# EAGLE design LayerOne2015 (EAGLE 7.2.0)

## Sheet 1 of 2
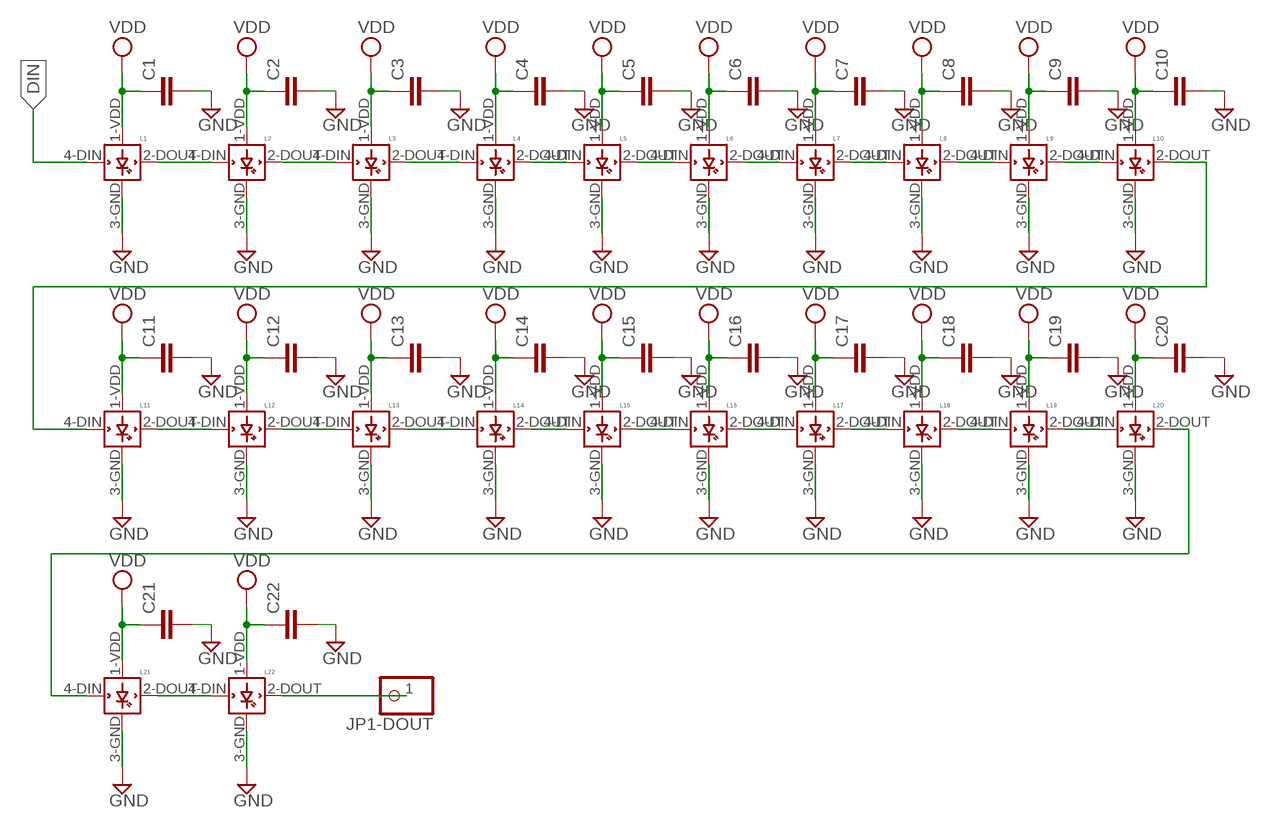
[diagram p0: schematic, sheet 1]

### Parts
C1  CAP0805  [0805]
C2  CAP0805  [0805]
C3  CAP0805  [0805]
C4  CAP0805  [0805]
C5  CAP0805  [0805]
C6  CAP0805  [0805]
C7  CAP0805  [0805]
C8  CAP0805  [0805]
C9  CAP0805  [0805]
C10  CAP0805  [0805]
C11  CAP0805  [0805]
C12  CAP0805  [0805]
C13  CAP0805  [0805]
C14  CAP0805  [0805]
C15  CAP0805  [0805]
C16  CAP0805  [0805]
C17  CAP0805  [0805]
C18  CAP0805  [0805]
C19  CAP0805  [0805]
C20  CAP0805  [0805]
C21  CAP0805  [0805]
C22  CAP0805  [0805]
JP1-DOUT  PINHD-1X1CB  [1X01-CLEANBIG]
L1  WS2812B  [WS2812B]
L2  WS2812B  [WS2812B]
L3  WS2812B  [WS2812B]
L4  WS2812B  [WS2812B]
L5  WS2812B  [WS2812B]
L6  WS2812B  [WS2812B]
L7  WS2812B  [WS2812B]
L8  WS2812B  [WS2812B]
L9  WS2812B  [WS2812B]
L10  WS2812B  [WS2812B]
L11  WS2812B  [WS2812B]
L12  WS2812B  [WS2812B]
L13  WS2812B  [WS2812B]
L14  WS2812B  [WS2812B]
L15  WS2812B  [WS2812B]
L16  WS2812B  [WS2812B]
L17  WS2812B  [WS2812B]
L18  WS2812B  [WS2812B]
L19  WS2812B  [WS2812B]
L20  WS2812B  [WS2812B]
L21  WS2812B  [WS2812B]
L22  WS2812B  [WS2812B]

### Nets
DIN: L1.4-DIN(DIN) ; also sheet 2
GND: C1.2 C2.2 C3.2 C4.2 C5.2 C6.2 C7.2 C8.2 C9.2 C10.2 C11.2 C12.2 C13.2 C14.2 C15.2 C16.2 C17.2 C18.2 C19.2 C20.2 C21.2 C22.2 L1.3-GND(GND) L2.3-GND(GND) L3.3-GND(GND) L4.3-GND(GND) L5.3-GND(GND) L6.3-GND(GND) L7.3-GND(GND) L8.3-GND(GND) L9.3-GND(GND) L10.3-GND(GND) L11.3-GND(GND) L12.3-GND(GND) L13.3-GND(GND) L14.3-GND(GND) L15.3-GND(GND) L16.3-GND(GND) L17.3-GND(GND) L18.3-GND(GND) L19.3-GND(GND) L20.3-GND(GND) L21.3-GND(GND) L22.3-GND(GND) ; also sheet 2
N$1: L1.2-DOUT(DOUT) L2.4-DIN(DIN)
N$2: L3.2-DOUT(DOUT) L4.4-DIN(DIN)
N$3: L4.2-DOUT(DOUT) L5.4-DIN(DIN)
N$4: L5.2-DOUT(DOUT) L6.4-DIN(DIN)
N$5: L6.2-DOUT(DOUT) L7.4-DIN(DIN)
N$6: L7.2-DOUT(DOUT) L8.4-DIN(DIN)
N$7: L8.2-DOUT(DOUT) L9.4-DIN(DIN)
N$8: L9.2-DOUT(DOUT) L10.4-DIN(DIN)
N$9: L11.2-DOUT(DOUT) L12.4-DIN(DIN)
N$10: L12.2-DOUT(DOUT) L13.4-DIN(DIN)
N$11: L13.2-DOUT(DOUT) L14.4-DIN(DIN)
N$12: L14.2-DOUT(DOUT) L15.4-DIN(DIN)
N$13: L15.2-DOUT(DOUT) L16.4-DIN(DIN)
N$14: L16.2-DOUT(DOUT) L17.4-DIN(DIN)
N$15: L17.2-DOUT(DOUT) L18.4-DIN(DIN)
N$16: L18.2-DOUT(DOUT) L19.4-DIN(DIN)
N$17: L19.2-DOUT(DOUT) L20.4-DIN(DIN)
N$18: L21.2-DOUT(DOUT) L22.4-DIN(DIN)
N$19: JP1-DOUT.1 L22.2-DOUT(DOUT)
N$25: L10.2-DOUT(DOUT) L11.4-DIN(DIN)
N$26: L20.2-DOUT(DOUT) L21.4-DIN(DIN)
N$27: L2.2-DOUT(DOUT) L3.4-DIN(DIN)
VCC: C1.1 C2.1 C3.1 C4.1 C5.1 C6.1 C7.1 C8.1 C9.1 C10.1 C11.1 C12.1 C13.1 C14.1 C15.1 C16.1 C17.1 C18.1 C19.1 C20.1 C21.1 C22.1 L1.1-VDD(VDD) L2.1-VDD(VDD) L3.1-VDD(VDD) L4.1-VDD(VDD) L5.1-VDD(VDD) L6.1-VDD(VDD) L7.1-VDD(VDD) L8.1-VDD(VDD) L9.1-VDD(VDD) L10.1-VDD(VDD) L11.1-VDD(VDD) L12.1-VDD(VDD) L13.1-VDD(VDD) L14.1-VDD(VDD) L15.1-VDD(VDD) L16.1-VDD(VDD) L17.1-VDD(VDD) L18.1-VDD(VDD) L19.1-VDD(VDD) L20.1-VDD(VDD) L21.1-VDD(VDD) L22.1-VDD(VDD) ; supply symbol labelled VDD ; also sheet 2

## Sheet 2 of 2
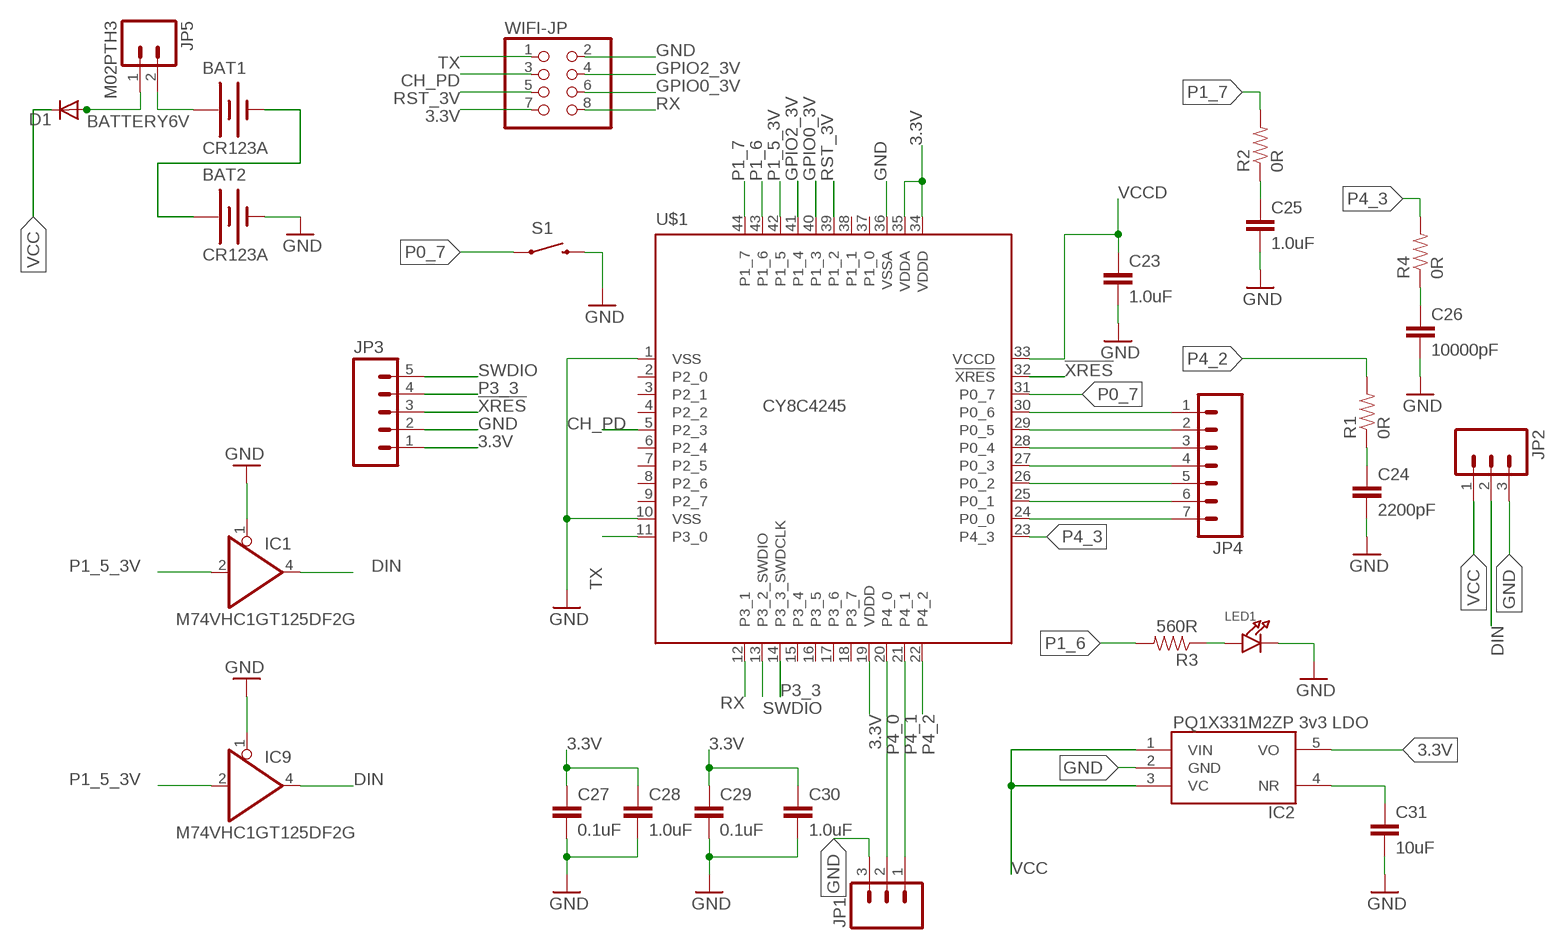
[diagram p1: schematic, sheet 2]

### Parts
BAT1  CR123A  TVBGONE-ADJ_BATTERYCR123A  [TVBGONE-ADJ_BATTERY_CR123A]
BAT2  CR123A  TVBGONE-ADJ_BATTERYCR123A  [TVBGONE-ADJ_BATTERY_CR123A]
C23  1.0uF  CAP0805  [0805]
C24  2200pF  CAP0805  [0805]
C25  1.0uF  CAP0805  [0805]
C26  10000pF  CAP0805  [0805]
C27  0.1uF  CAP0805  [0805]
C28  1.0uF  CAP0805  [0805]
C29  0.1uF  CAP0805  [0805]
C30  1.0uF  CAP0805  [0805]
C31  10uF  CAP0805  [0805]
D1  DIODESMA  [SMA-DIODE]
IC1  M74VHC1GT125DF2G  74AHCT1G125DBV  [SOT23-5]
IC2  PQ1X331M2ZP-3V3-LDO-SOT-23-5  [SOT-23-5]
IC9  M74VHC1GT125DF2G  74AHC1G125DCK  [SC70-5]
JP1  M031X03_NO_SILK  [1X03_NO_SILK]
JP2  M031X03_NO_SILK  [1X03_NO_SILK]
JP3  M05PTH  [1X05]
JP4  M07  [1X07]
JP5  M02PTH3  [1X02_LONGPADS]
LED1  LED0805  [CHIPLED_0805]
R1  0R  RESISTOR0805-RES  [0805]
R2  0R  RESISTOR0805-RES  [0805]
R3  560R  RESISTOR0805-RES  [0805]
R4  0R  RESISTOR0805-RES  [0805]
S1  SPARKFUN_SWITCH-MOMENTARY-2SMD  [SPARKFUN_TACTILE_SWITCH_SMD]
U$1  CY8C4245  CY8C4245AXI-483  [TQFP44]
WIFI-JP  PINHD-2X4  [2X04]

### Nets
3.3V: C27.1 C28.1 C29.1 C30.1 IC2.5(VO) JP3.1 U$1.19(VDDD) U$1.34(VDDD) U$1.35(VDDA) WIFI-JP.7
!XRES: JP3.3 U$1.32(!XRES)
BATTERY6V: D1.A JP5.1
CH_PD: U$1.5(P2_3) WIFI-JP.3
DIN: IC1.4(O) IC9.4(O) JP2.2 ; also sheet 1
GND: BAT2.- C23.2 C24.2 C25.2 C26.2 C27.2 C28.2 C29.2 C30.2 C31.2 IC1.1(OE) IC2.2(GND) IC9.1(OE) JP1.3 JP2.3 JP3.2 LED1.C S1.3 U$1.1(VSS) U$1.10(VSS) U$1.36(VSSA) WIFI-JP.2 ; also sheet 1
GPIO0_3V: U$1.40(P1_3) WIFI-JP.6
GPIO2_3V: U$1.41(P1_4) WIFI-JP.4
N$20: C24.1 R1.1
N$21: C25.1 R2.1
N$22: C26.1 R4.1
N$23: LED1.A R3.1
N$24: C31.1 IC2.4(NR)
N$28: BAT1.- BAT2.+
N$29: JP4.7 U$1.24(P0_0)
N$30: JP4.6 U$1.25(P0_1)
N$31: JP4.5 U$1.26(P0_2)
N$32: JP4.4 U$1.27(P0_3)
N$33: JP4.3 U$1.28(P0_4)
N$34: JP4.2 U$1.29(P0_5)
N$35: JP4.1 U$1.30(P0_6)
N$36: BAT1.+ JP5.2
P0_7: S1.1 U$1.31(P0_7)
P1_5_3V: IC1.2(I) IC9.2(I) U$1.42(P1_5)
P1_6: R3.2 U$1.43(P1_6)
P1_7: R2.2 U$1.44(P1_7)
P3_3: JP3.4 U$1.14(P3_3_SWDCLK)
P4_0: JP1.2 U$1.20(P4_0)
P4_1: JP1.1 U$1.21(P4_1)
P4_2: R1.2 U$1.22(P4_2)
P4_3: R4.2 U$1.23(P4_3)
RST_3V: U$1.39(P1_2) WIFI-JP.5
RX: U$1.12(P3_1) WIFI-JP.8
SWDIO: JP3.5 U$1.13(P3_2_SWDIO)
TX: U$1.11(P3_0) WIFI-JP.1
VCC: D1.C IC2.1(VIN) IC2.3(VC) JP2.1 ; also sheet 1
VCCD: C23.1 U$1.33(VCCD)
Unconnected: U$1.2(P2_0) U$1.3(P2_1) U$1.4(P2_2) U$1.6(P2_4) U$1.7(P2_5) U$1.8(P2_6) U$1.9(P2_7) U$1.15(P3_4) U$1.16(P3_5) U$1.17(P3_6) U$1.18(P3_7) U$1.37(P1_0) U$1.38(P1_1)

## Power pins joined to a net without a drawn wire
GND: IC1.3(GND) IC9.3(GND)
VCC: IC1.5(VCC) IC9.5(VCC)

## Library data of the parts
BAT1 BAT2 = tvbgone-2layer:TVBGONE-ADJ_BATTERY: Battery Holders Various common sizes : AA, AAA, 20mm coin cell and 12mm coin cell.
C1-C22 = SparkFun-Passives:CAP: Capacitor Standard 0603 ceramic capacitor, and 0.1" leaded capacitor.
C23-C31 = SparkFun-Capacitors:CAP: Capacitor Standard 0603 ceramic capacitor, and 0.1" leaded capacitor.
D1 = SparkFun-DiscreteSemi:DIODE: Diode These are standard reverse protection diodes and small signal diodes. SMA package can handle up to about 1A. SOD-323 can handle about 200mA. What the SOD-323 package when ordering, there are some mfgs out there that are 5-pin packages.
IC1 IC9 = 74xx-little-de:74*1G125: Single Bus Buffer Gate with 3-State Output; DIGIKEY-ND: M74VHC1GT125DF1GOSCT-ND; MOUSER: 863-M74VHC1GT125DF2G; PARTNO: M74VHC1GT125DF2G
IC2 = STM32-PROX:PQ1X331M2ZP-3V3-LDO-SOT-23-5
JP1 JP2 = SparkFun-Connectors:M03: Header 3 Standard 3-pin 0.1" header. Use with straight break away headers (SKU : PRT-00116), right angle break away headers (PRT-00553), swiss pins (PRT-00743), machine pins (PRT-00117), and female headers (PRT-00115). Molex polarized connector foot print use with SKU : PRT-08232 with associated crimp pins and housings.
JP1-DOUT = adafruit:PINHD-1X1: Pin header 1x1 for 0.1" spacing With round pins
JP3 = SparkFun-Connectors:M05: Header 5 Standard 5-pin 0.1" header. Use with straight break away headers (SKU : PRT-00116), right angle break away headers (PRT-00553), swiss pins (PRT-00743), machine pins (PRT-00117), and female headers (PRT-00115). Molex polarized connector foot print use with SKU : PRT-08230 with associated crimp pins and housings.
JP4 = SparkFun:M07: Header 7 Standard 7-pin 0.1" header. Use with straight break away headers (SKU : PRT-00116), right angle break away headers (PRT-00553), swiss pins (PRT-00743), machine pins (PRT-00117), and female headers (PRT-00115). NOTES ON THE VARIANTS LOCK and LOCK_LONGPADS... This footprint was designed to help hold the alignment of a through-hole component (i.e. 7-pin header) while soldering it into place. You may notice that each hole has been shifted either up or down by 0.005 of an inch from it's more standard position (which is usually a perfectly straight line). This slight alteration caused the pins (the squares in the middle) to touch the edges of the holes. Because they are alternating, it causes a "brace" to hold the header in place. 0.005 has proven to be the perfect amount of "off-center" position when using our standard breakaway headers. Although looks a little odd when you look at the bare footprint, once you have a header in there, the alteration is very hard to notice. Also, if you push a header all the way into place, it is covered up entirely on the bottom side. This idea of altering the position of holes to aid alignment will be further integrated into the Sparkfun Library for other footprints. It can help hold any component with 3 or more connection pins.
JP5 = SparkFun-Connectors:M02: Standard 2-pin 0.1" header. Use with - straight break away headers ( PRT-00116) - right angle break away headers (PRT-00553) - swiss pins (PRT-00743) - machine pins (PRT-00117) - female headers (PRT-00115) Molex polarized connector foot print use with: PRT-08233 with associated crimp pins and housings. 2.54_SCREWTERM for use with PRT-10571. 3.5mm Screw Terminal footprints for PRT-08084 5mm Screw Terminal footprints for use with PRT-08433
L1-L22 = adafruit:WS2812B
LED1 = microbuilder:LED: LED 0603 - 0603 Surface Mount Package Green LED - Low Power (3.9mcd, 2ma, 1.7Vf) Orange LED - Low Power (9.8mcd, 2ma, 1.8Vf) Red LED - Low Power (5mcd, 2ma, 1.8Vf) Yellow LED - Low Power (7mcd, 2ma, 1.8Vf) 0805 - 0805 Surface Mount Package 20mA: Red LED (104mcd, 20mA, Diffused) - LS R976 [Digikey: 475-1278-6-ND] Red LED (12mcd, 20mA, 2.0Vf, Clear) - APT2012EC [Digikey: 754-1128-1-ND] Green LED (15mcd, 20mA, 2.2Vf, Clear) - APT2012GC [Digikey: 754-1131-1-ND] Orange LED (160mcd, 20mA, 2.1Vf, Clear) - APT2012SECK [Digikey: 754-1130-1-ND] 2mA: Red LED (8.8mcd, 2mA, 1.8Vf, Clear) - Low Power [Digikey: 475-2510-1-ND] Green LED (5mcd, 2mA, 1.8Vf, Clear) - Low Power [Digikey: 475-2730-1-ND] Yellow LED (11.3mcd, 2mA, 1.8Vf, Clear) - Low Power [Digikey: 475-2555-1-ND] 1206 - 1206 Surface Mount Package Green LED (26mcd, 20mA, Diffused) - LG N971 [Digikey: 475-1407-6-ND] Red LED (15mcd, 20mA, Diffused) - LH N974 [Digikey: 475-1416-6-ND]
R1-R4 = SparkFun-Resistors:RESISTOR: Resistor Basic schematic elements and footprints for 0603, 1206, and PTH resistors.
S1 = Nullspace:SPARKFUN_SWITCH-MOMENTARY-2
U$1 = cypress:CY8C4245AXI-483
WIFI-JP = pinhead:PINHD-2X4: PIN HEADER

## Net classes
0 default: width 0.203 mm

## Board
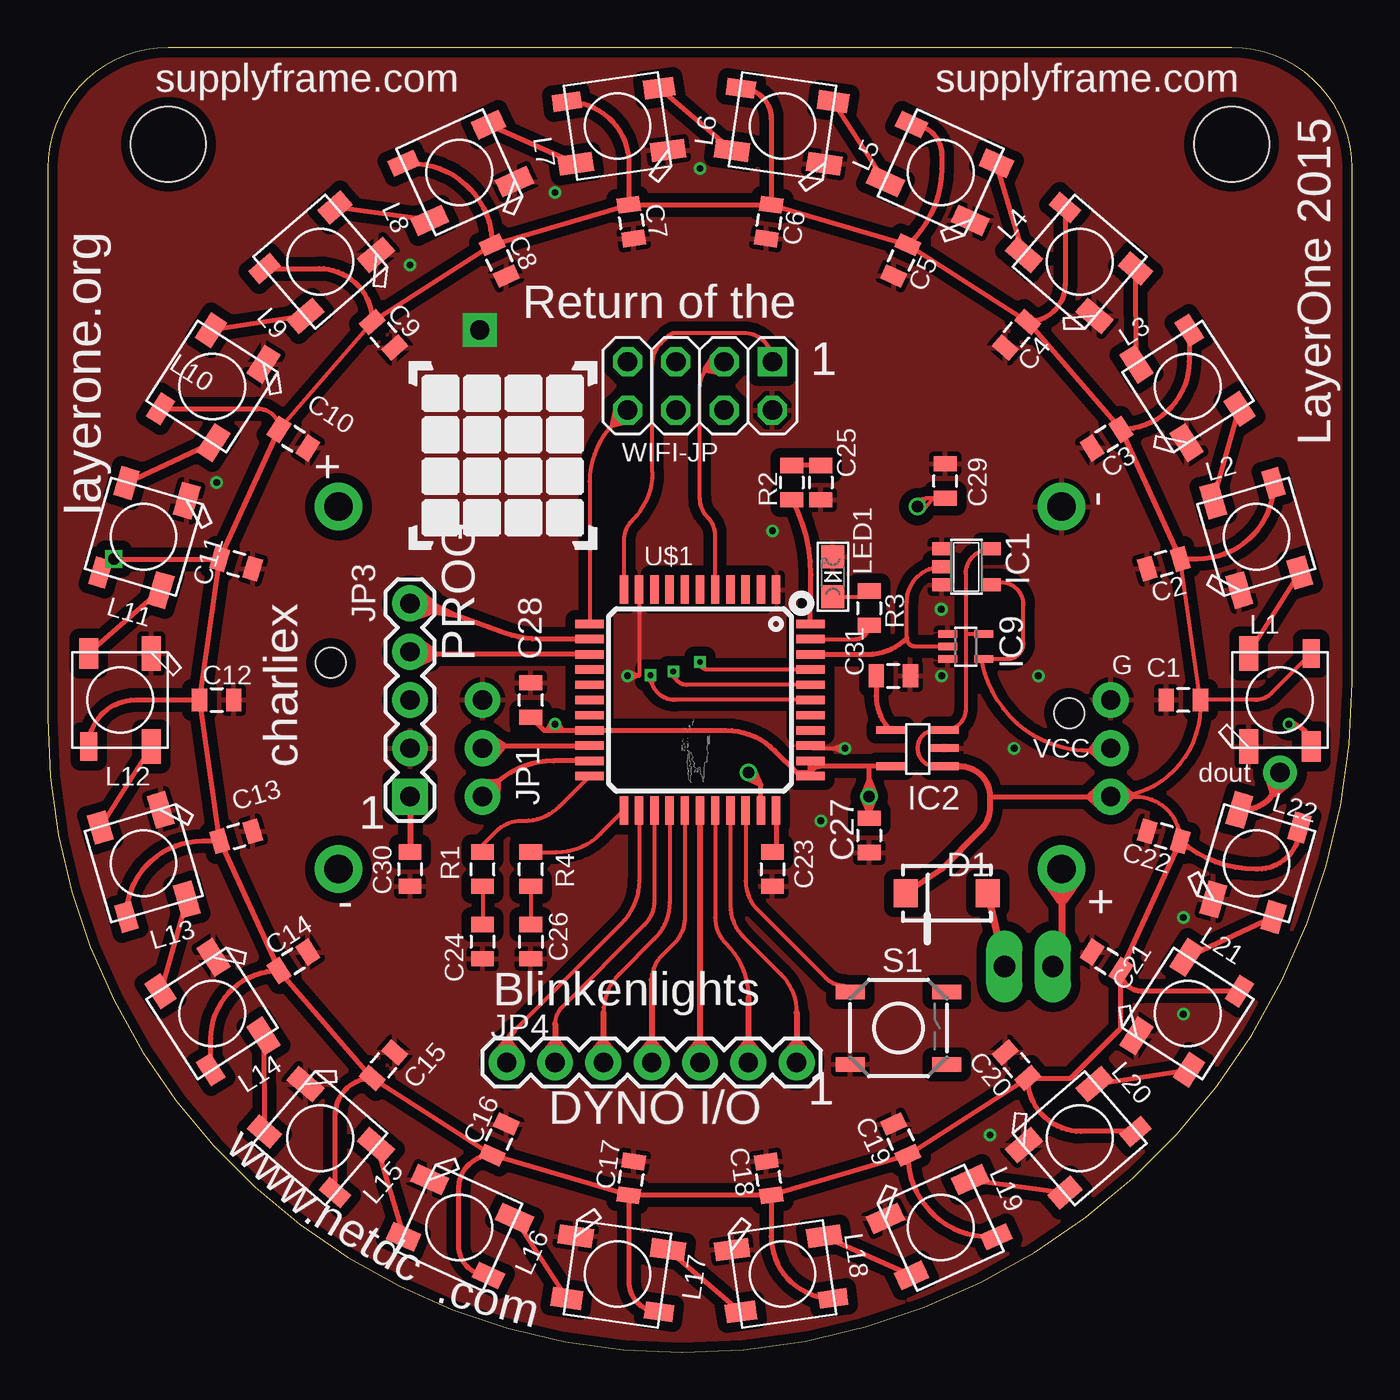
[diagram p2: board, top side]
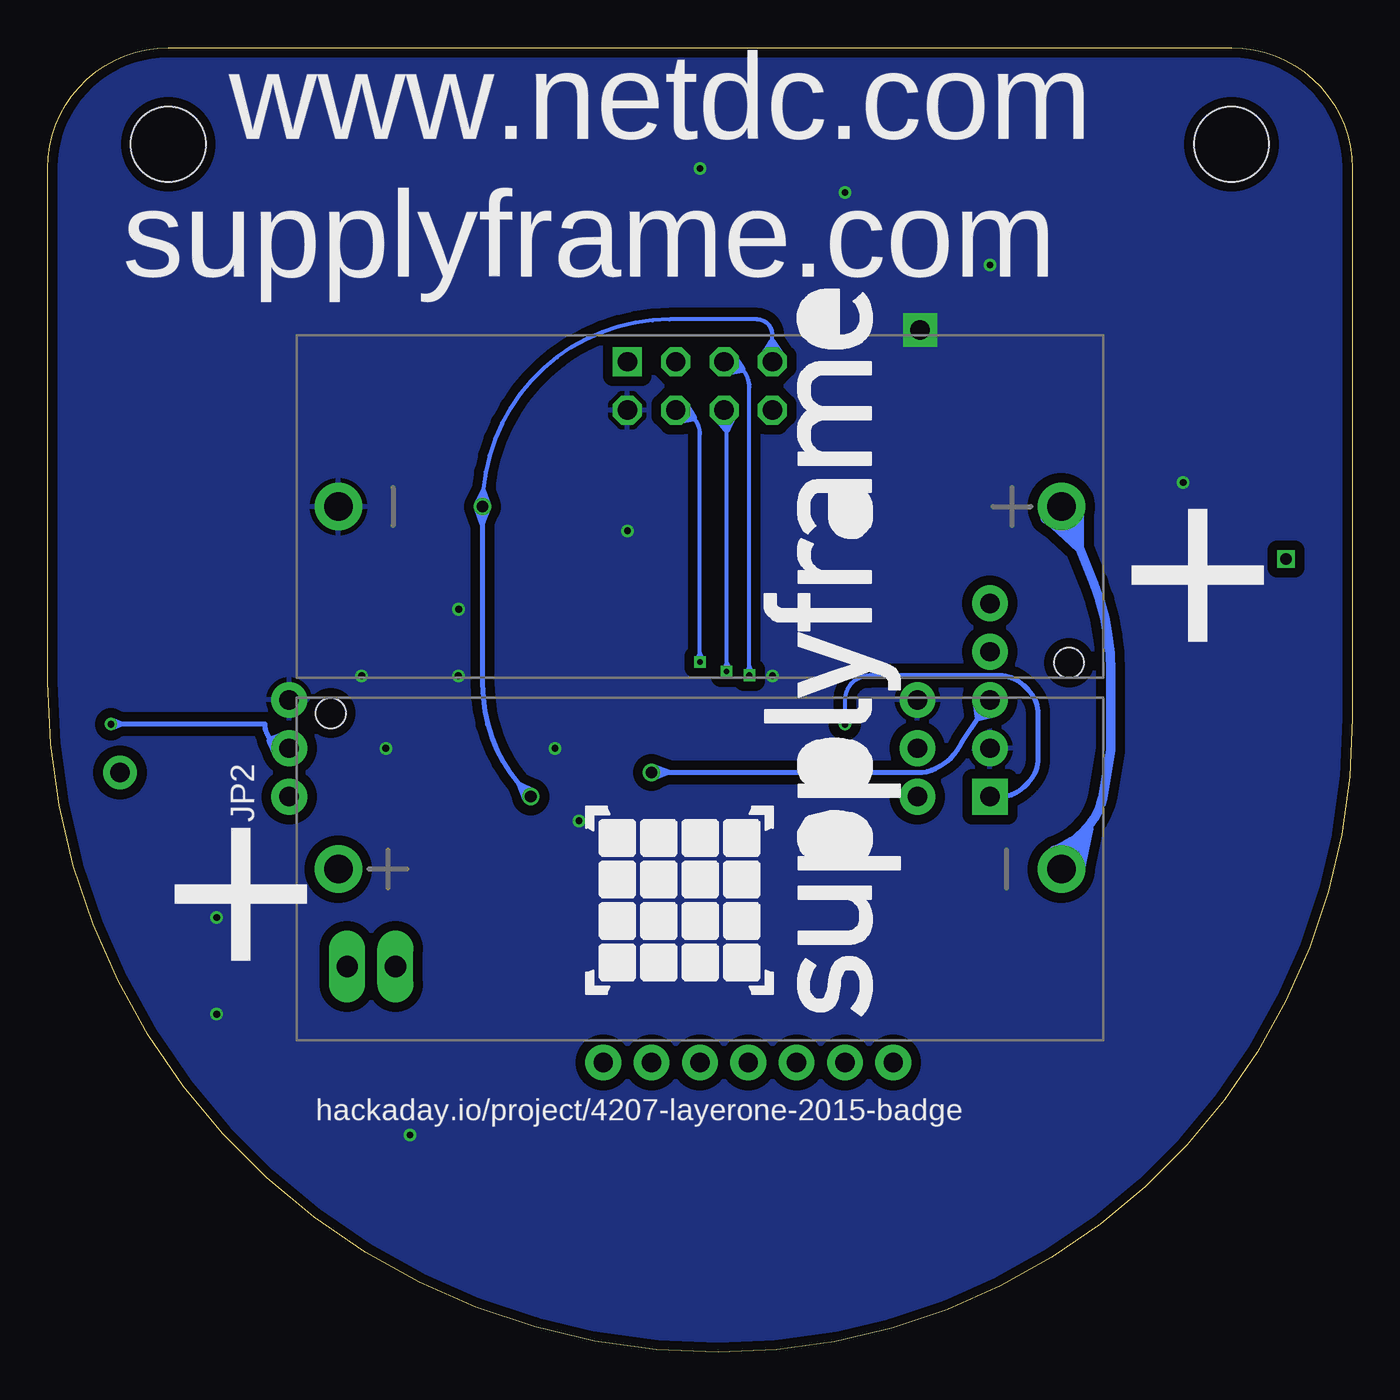
[diagram p3: board, bottom side, seen from below]

Size 68.58 x 68.58 mm. Coordinates in mm from the lower left corner, seen from the top.
Outline: 0,33.34 arc90 33.34,0 arc90 68.56,35.22 68.58,62.23 arc90 62.23,68.58 6.35,68.58 arc90 0,62.23 0,33.34
Copper layers (1*16): Top 0.035mm / dielectric 1.5mm / Bottom 0.035mm
Design rules "ITEADstudio_DRC": minimum track width 6mil, minimum drill 12mil, track to track 6mil, track to pad 6mil, pad to pad 6mil, via to via 6mil, smd to smd 0mil, copper to edge 10mil, drill to drill 10mil, minimum pad ring 10mil, minimum via ring 6mil, stop-mask expansion 2mil, vias tented up to drill 100mil, thermal gap 10mil
Holes 3.94 mm at 62.23,63.5 6.35,63.5
Milling: 7 lines

### Footprints (pad centres in the part's own frame; a part is rotated, then mirrored left to right if it is on the bottom)
TVBGONE-ADJ_BATTERY_CR123A = drill 1.5 pad 2.5: + 19,0; - -19,0 | hole 1.575: 19.4,-8.2
0805 = smd 0.8 x 1.2: 1 -0.9,0; 2 0.9,0
SMA-DIODE = smd 1.27 x 1.47: A -2.15,0; C 2.15,0
SOT23-5 = smd 0.69 x 0.99: 1 -0.95,-1.29; 2 0,-1.29; 3 0.95,-1.29; 4 0.95,1.3; 5 -0.95,1.3
SOT-23-5 = smd 0.4 x 1.5: 1 -0.94,-1.422; 2 0.01,-1.422; 3 0.96,-1.422; 4 0.96,1.428; 5 -0.94,1.428
SC70-5 = smd 0.4 x 1: 1 -0.65,-0.95; 2 0,-0.95; 3 0.65,-0.95; 4 0.65,0.95; 5 -0.65,0.95
1X03_NO_SILK = drill 1.016 pad 1.88: 1 0,0; 2 2.54,0; 3 5.08,0
1X01-CLEANBIG = drill 1.016 pad 1.778: 1 0,0
1X05 = drill 1.016 pad 1.88 square: 1 0,0 | drill 1.016 pad 1.88: 2 2.54,0; 3 5.08,0; 4 7.62,0; 5 10.16,0
1X07 = drill 1.016 pad 1.88: 1 0,0; 2 2.54,0; 3 5.08,0; 4 7.62,0; 5 10.16,0; 6 12.7,0; 7 15.24,0
1X02_LONGPADS = drill 1.118 pad 1.88 long: 1 0,0; 2 2.54,0
WS2812B = smd 1.5 x 0.9: 1-VDD 2.45,-1.65 | smd 1.8 x 1: 2-DOUT 2.45,1.65; 3-GND -2.45,1.65 | smd 1.6 x 1: 4-DIN -2.45,-1.65
CHIPLED_0805 = smd 1.2 x 1.2: A 0,-1.05; C 0,1.05
SPARKFUN_TACTILE_SWITCH_SMD = smd 1.524 x 0.762: 1 -2.54,1.905; 2 2.54,1.905; 3 -2.54,-1.905; 4 2.54,-1.905
TQFP44 = smd 1.5 x 0.44: 1 -5.8,4; 2 -5.8,3.2; 3 -5.8,2.4; 4 -5.8,1.6; 5 -5.8,0.8; 6 -5.8,0; 7 -5.8,-0.8; 8 -5.8,-1.6; 9 -5.8,-2.4; 10 -5.8,-3.2; 11 -5.8,-4; 23 5.8,-4; 24 5.8,-3.2; 25 5.8,-2.4; 26 5.8,-1.6; 27 5.8,-0.8; 28 5.8,0; 29 5.8,0.8; 30 5.8,1.6; 31 5.8,2.4; 32 5.8,3.2; 33 5.8,4 | smd 0.44 x 1.5: 12 -4,-5.8; 13 -3.2,-5.8; 14 -2.4,-5.8; 15 -1.6,-5.8; 16 -0.8,-5.8; 17 0,-5.8; 18 0.8,-5.8; 19 1.6,-5.8; 20 2.4,-5.8; 21 3.2,-5.8; 22 4,-5.8; 34 4,5.8; 35 3.2,5.8; 36 2.4,5.8; 37 1.6,5.8; 38 0.8,5.8; 39 0,5.8; 40 -0.8,5.8; 41 -1.6,5.8; 42 -2.4,5.8; 43 -3.2,5.8; 44 -4,5.8
2X04 = drill 1.016 square: 1 -3.81,-1.27 | drill 1.016 octagon: 2 -3.81,1.27; 3 -1.27,-1.27; 4 -1.27,1.27; 5 1.27,-1.27; 6 1.27,1.27; 7 3.81,-1.27; 8 3.81,1.27

### Placement (x,y rotation side)
BAT1  34.29,25.4 180 bottom
BAT2  34.29,44.45 0 bottom
C1  59.69,34.29 180 top
C2  58.66,41.45 196.3 top
C3  55.66,48.02 212.7 top
C4  50.92,53.49 229.1 top
C5  44.84,57.39 245.5 top
C6  37.9,59.43 261.8 top
C7  30.68,59.43 278.2 top
C8  23.74,57.39 294.5 top
C9  17.66,53.49 310.9 top
C10  12.92,48.02 327.3 top
C11  9.92,41.45 343.7 top
C12  8.89,34.29 0 top
C13  9.92,27.13 16.3 top
C14  12.92,20.56 32.7 top
C15  17.66,15.09 49.1 top
C16  23.74,11.19 65.5 top
C17  30.68,9.15 81.8 top
C18  37.9,9.15 98.2 top
C19  44.84,11.19 114.5 top
C20  50.92,15.09 130.9 top
C21  55.66,20.56 147.3 top
C22  58.66,27.13 163.7 top
C23  38.1,25.4 270 top
C24  22.86,21.59 270 top
C25  40.64,45.72 270 top
C26  25.4,21.59 270 top
C27  43.18,27.17 270 top
C28  25.4,34.29 90 top
C29  47.18,45.8 90 top
C30  19.05,25.4 270 top
C31  44.45,35.56 0 top
D1  47.26,24.13 180 top
IC1  48.29,41.29 270 top
IC2  45.72,31.75 90 top
IC9  48.26,37.1 270 top
JP1  22.86,29.21 90 top
JP1-DOUT  64.77,30.48 90 top
JP2  55.88,29.21 90 bottom
JP3  19.05,29.21 90 top
JP4  39.37,15.24 180 top
JP5  50.29,20.29 0 top
L1  64.77,34.29 90 top
L2  63.54,42.88 106.3 top
L3  59.93,50.77 122.7 top
L4  54.25,57.33 139.1 top
L5  46.95,62.02 155.5 top
L6  38.63,64.46 171.8 top
L7  29.95,64.46 188.2 top
L8  21.63,62.02 204.5 top
L9  14.33,57.33 220.9 top
L10  8.65,50.77 237.3 top
L11  5.04,42.88 253.7 top
L12  3.81,34.29 270 top
L13  5.04,25.7 286.3 top
L14  8.65,17.81 302.7 top
L15  14.33,11.25 319.1 top
L16  21.63,6.56 335.5 top
L17  29.95,4.12 351.8 top
L18  38.63,4.12 8.2 top
L19  46.95,6.56 24.5 top
L20  54.25,11.25 40.9 top
L21  59.93,17.81 57.3 top
L22  63.54,25.7 73.7 top
LED1  41.27,40.77 0 top
R1  22.86,25.4 90 top
R2  39.12,45.72 270 top
R3  43.18,39.12 270 top
R4  25.4,25.4 90 top
S1  44.72,17.05 0 top
U$1  34.29,34.29 270 top
WIFI-JP  34.29,50.8 180 top

### Tracks (layer width: path | path; a pad name or v marks a point on that pad's centre or on a via)
3.3V  (via drill 0.36, 0.61)
  Top 0.203: v26.67,33.02 26.67,32.69 | v43.18,29.21 43.18,28.3 | 43.18,28.3 C27.1 | C29.1 46.52,44.9 | 46.52,44.9 46.17,44.9 v45.72,44.45 | 46.52,44.9 45.68,44.8 v45.72,44.45 | 46.52,44.9 46,44.23 v45.72,44.45 | 43.18,28.3 43.51,29.07 v43.18,29.21 | 43.18,28.3 42.85,29.07 v43.18,29.21
  Top 0.254: U$1.34 U$1.35 | IC2.5 43.18,30.81 | 43.18,30.81 40.61,30.81 arc90 U$1.34 | C28.1 26.1,32.69 26.25,32.69 | 26.25,32.69 26.67,32.69 27.09,32.69 | 27.09,32.69 U$1.19 35.66,32.69 arc-45 38.22,31.63 39.37,30.48 39.9,30.48 U$1.34 | v43.18,29.21 43.18,30.12 | 43.18,30.12 43.18,30.81 | 43.18,30.12 42.87,29.33 v43.18,29.21 | 43.18,30.12 43.49,29.33 v43.18,29.21 | 26.25,32.69 26.72,32.82 v26.67,33.02 | 26.25,32.69 26.49,33.12 v26.67,33.02 | 27.09,32.69 26.85,33.12 v26.67,33.02 | 27.09,32.69 26.61,32.82 v26.67,33.02
  Top 0.305: JP3.1 C30.1
  Bottom 0.203: 25.4,35.56 arc-90 26.67,34.29 26.67,33.55 | 26.67,33.55 v26.67,33.02 | WIFI-JP.7 30.48,53.09 30.48,53.48 arc-90 31.29,54.29 35.88,54.29 arc-85 45.68,45.36 | 45.68,45.36 arc-5 v45.72,44.45 | 45.68,45.36 45.39,44.57 v45.72,44.45 | 45.68,45.36 46.04,44.6 v45.72,44.45 | 26.67,33.55 26.46,33.12 v26.67,33.02 | 26.67,33.55 26.88,33.12 v26.67,33.02
  Bottom 0.254: JP3.1 18.52,29.21 arc-45 17.25,29.74 17.04,29.95 arc-45 16.51,31.22 16.51,33.55 arc-45 17.04,34.82 17.25,35.03 arc-45 18.52,35.56 25.4,35.56 | v45.72,44.45 45.72,43.54 | 45.72,43.54 45.72,35.12 arc-45 43.34,29.37 v43.18,29.21 | 45.72,43.54 46.03,44.33 v45.72,44.45 | 45.72,43.54 45.41,44.33 v45.72,44.45 | v43.18,29.21 43.04,29.51 43.81,29.88 43.49,29.09 v43.18,29.21
  Bottom 0.406: 30.48,53.09 30.01,52.38 WIFI-JP.7 30.95,52.38 30.48,53.09
!XRES  (via drill 0.61)
  Top 0.254: U$1.32 37.49,29.82 37.48,29.83 | 37.48,29.83 v36.83,30.48 | 37.48,29.83 37.13,30.61 v36.83,30.48 | 37.48,29.83 36.7,30.18 v36.83,30.48
  Bottom 0.254: v36.83,30.48 35.92,30.48 | 35.92,30.48 22.61,30.48 arc-56 20.52,32.08 19.61,33.45 JP3.3 | 35.92,30.48 36.71,30.17 v36.83,30.48 | 35.92,30.48 36.71,30.79 v36.83,30.48
  Bottom 0.508: 19.61,33.45 19.73,34.19 JP3.3 18.89,33.62 19.61,33.45
BATTERY6V
  Top 0.381: D1.A JP5.1
CH_PD
  Top 0.203: U$1.5 35.09,42.94 arc45 34.7,43.88 arc-45 34.29,44.88 34.29,50.8 arc-90 WIFI-JP.3
  Top 0.406: 34.63,51.66 35.46,51.52 WIFI-JP.3 35.09,52.38 34.63,51.66
DIN  (via drill 0.36)
  Top 0.203: JP2.2 arc-10 54.87,31.64 arc-80 49.11,36.25 IC9.4 50.45,36.45 arc90 51.29,37.29 51.29,39.29 arc117 IC1.4
  Top 0.254: v65.24,33.02 arc-26 65.76,32.9 | 65.76,32.9 arc-64 L1.4-DIN | 65.76,32.9 65.36,33.19 v65.24,33.02 | 65.76,32.9 65.27,32.82 v65.24,33.02
  Top 0.406: 54.87,31.64 55.41,31.19 JP2.2 55.29,32.2 54.87,31.64
  Bottom 0.254: JP2.2 arc90 57.15,33.02 64.71,33.02 | 64.71,33.02 v65.24,33.02 | 64.71,33.02 65.16,32.83 v65.24,33.02 | 64.71,33.02 65.16,33.21 v65.24,33.02
  Bottom 0.508: 56.81,32.16 56.1,32.4 JP2.2 56.51,31.47 56.81,32.16
GND  (via drill 0.36, 1.02 pad 1.78)
  Top 0.203: U$1.36 40.23,31.75 41.38,31.75 | 41.38,31.75 v41.91,31.75 | U$1.10 31.09,35.56 31.01,35.56 | 31.01,35.56 v30.48,35.56 | 41.38,31.75 41.81,31.54 v41.91,31.75 | 41.38,31.75 41.81,31.96 v41.91,31.75 | 31.01,35.56 30.58,35.77 v30.48,35.56 | 31.01,35.56 30.58,35.35 v30.48,35.56
  other vias: 19.05,57.15 26.67,60.96 34.29,62.23 8.89,45.72 59.69,22.86 50.8,31.75 46.99,35.56 52.07,35.56 40.64,27.94 59.69,17.78 49.53,11.43 38.1,43.18 22.72,53.74 46.97,39.06
  pour Top (isolate 0.508): 68.58,68.58 0,68.58 0,33.34 arc90 33.34,0 arc90 68.58,35.24
  pour Bottom (isolate 0.508): 68.58,68.58 0,68.58 0,33.34 arc90 33.34,0 33.55,0 arc90 68.58,35.03
GPIO0_3V  (via drill 0.3)
  Top 0.203: U$1.40 33.59,35.09 arc-52 33.04,35.36 | 33.04,35.36 arc-38 v32.89,35.79 | 33.04,35.36 33.09,35.76 v32.89,35.79 | 33.04,35.36 32.75,35.64 v32.89,35.79
  Bottom 0.203: v32.89,35.79 32.89,36.25 | 32.89,36.25 32.89,48.52 32.89,49.4 arc-90 WIFI-JP.6 | 32.89,36.25 32.71,35.88 v32.89,35.79 | 32.89,36.25 33.07,35.88 v32.89,35.79
  Bottom 0.406: 32.89,48.52 33.44,49.16 WIFI-JP.6 32.52,49.28 32.89,48.52
GPIO2_3V  (via drill 0.3)
  Top 0.203: U$1.41 34.69,35.89 arc-20 34.55,35.91 | 34.55,35.91 arc-70 v34.29,36.29 | 34.55,35.91 34.49,36.32 v34.29,36.29 | 34.55,35.91 34.19,36.11 v34.29,36.29
  Bottom 0.203: v34.29,36.29 34.29,36.75 | 34.29,36.75 34.29,48.26 arc-90 WIFI-JP.4 | 34.29,36.75 34.11,36.38 v34.29,36.29 | 34.29,36.75 34.47,36.38 v34.29,36.29
  Bottom 0.406: 34.63,49.12 35.46,48.98 WIFI-JP.4 35.09,49.84 34.63,49.12
N$1
  Top 0.254: L1.2-DOUT L2.4-DIN
N$2
  Top 0.254: L3.2-DOUT L4.4-DIN
N$3
  Top 0.254: L4.2-DOUT L5.4-DIN
N$4
  Top 0.254: L5.2-DOUT L6.4-DIN
N$5
  Top 0.254: L6.2-DOUT L7.4-DIN
N$6
  Top 0.254: L7.2-DOUT L8.4-DIN
N$7
  Top 0.254: L8.2-DOUT L9.4-DIN
N$8
  Top 0.254: L9.2-DOUT L10.4-DIN
N$9
  Top 0.254: L11.2-DOUT L12.4-DIN
N$10
  Top 0.254: L12.2-DOUT L13.4-DIN
N$11
  Top 0.254: L13.2-DOUT L14.4-DIN
N$12
  Top 0.254: L14.2-DOUT L15.4-DIN
N$13
  Top 0.254: L15.2-DOUT L16.4-DIN
N$14
  Top 0.254: L16.2-DOUT L17.4-DIN
N$15
  Top 0.254: L17.2-DOUT L18.4-DIN
N$16
  Top 0.254: L18.2-DOUT L19.4-DIN
N$17
  Top 0.254: L19.2-DOUT L20.4-DIN
N$18
  Top 0.254: L21.2-DOUT L22.4-DIN
N$19
  Top 0.254: L22.2-DOUT 62.81,28.52
  Top 0.305: 62.81,28.52 arc90 JP1-DOUT.1
  Top 0.61: 64.51,29.5 65.14,30.03 JP1-DOUT.1 64.22,30.28 64.51,29.5
N$20
  Top 0.203: R1.1 C24.1
N$21
  Top 0.254: C25.1 R2.1
N$22
  Top 0.203: R4.1 C26.1
N$23
  Top 0.203: LED1.A 43.18,39.72 R3.1
N$24
  Top 0.254: C31.1 43.55,34.5 arc45 IC2.4
N$25
  Top 0.254: L10.2-DOUT L11.4-DIN
N$26
  Top 0.254: L20.2-DOUT L21.4-DIN
N$27
  Top 0.254: L2.2-DOUT L3.4-DIN
N$28
  Bottom 0.508: BAT1.- 13.84,27.56 14.35,25.15 16.13,25.78 15.68,26.39 arc-57 13.13,29.14 12.7,31.64 arc-10 12.7,31.66 12.7,35.79 arc-22 13.59,40.43 15.19,44.45 arc96 15.11,44.62 14.35,44.83 14.35,42.29 16,43.81 16.13,43.81 15.37,44.45 BAT2.+
N$29
  Top 0.203: U$1.24 31.09,24.8 arc-45 30.15,22.53 24.5,16.88 | 24.13,15.98 JP4.7
  Top 0.305: 24.5,16.88 arc45 24.13,15.98
  Top 0.61: 24.16,16.26 23.65,15.65 JP4.7 24.64,15.62 24.16,16.26
N$30
  Top 0.203: U$1.25 31.89,23.75 arc-45 31.36,22.47 27.04,18.15 arc45 26.67,17.25
  Top 0.305: 26.67,17.25 26.67,16.26 JP4.6
  Top 0.61: 26.67,16.26 26.17,15.64 JP4.6 27.17,15.64 26.67,16.26
N$31
  Top 0.203: U$1.26 32.69,23.66 arc-45 31.89,21.73 30.04,19.88 arc45 29.21,17.87
  Top 0.305: 29.21,17.87 29.21,16.26 JP4.5
  Top 0.61: 29.21,16.26 28.71,15.64 JP4.5 29.71,15.64 29.21,16.26
N$32
  Top 0.203: U$1.27 33.49,22.85 arc-45 32.93,21.5 32.28,20.85 arc45 31.75,19.58
  Top 0.305: 31.75,19.58 31.75,16.26 JP4.4
  Top 0.61: 31.75,16.26 31.25,15.64 JP4.4 32.25,15.64 31.75,16.26
N$33
  Top 0.305: U$1.28 34.29,16.26 JP4.3
  Top 0.61: 34.29,16.26 33.79,15.64 JP4.3 34.79,15.64 34.29,16.26
N$34
  Top 0.203: U$1.29 35.09,22.85 arc45 35.65,21.5 arc-45 36.83,18.65
  Top 0.305: 36.83,18.65 36.83,16.26 JP4.2
  Top 0.61: 36.83,16.26 36.33,15.64 JP4.2 37.33,15.64 36.83,16.26
N$35
  Top 0.203: U$1.30 35.89,23.46 arc45 36.54,21.88 38.54,19.88 arc-45 39.37,17.87
  Top 0.305: 39.37,17.87 39.37,16.26 JP4.1
  Top 0.61: 39.37,16.26 38.87,15.64 JP4.1 39.87,15.64 39.37,16.26
N$36
  Top 0.381: BAT1.+ 53.29,23.9 53.29,20.75 JP5.2
  Top 0.762: 53.29,23.9 54,24.9 BAT1.+ 52.58,24.9 53.29,23.9
P0_7
  Top 0.203: U$1.31 36.69,24.77 arc45 37.31,23.27 40.9,19.68 arc45 41.84,19.29 S1.1
P1_5_3V
  Top 0.203: IC9.2 45.6,37.1 arc-90 45.16,37.54 45.16,39.45 arc-90 IC1.2
  Top 0.254: U$1.42 43.1,36.69 arc45 45.16,37.54
P1_6
  Top 0.203: U$1.43 42.45,37.49 arc90 R3.2
P1_7
  Top 0.254: U$1.44 40.11,40.89 arc30 R2.2
P3_3
  Top 0.254: U$1.14 20.45,36.7 19.56,36.32 19.56,37.21 20.06,36.92 20.46,36.69 20.06,36.73 JP3.4
  Top 0.508: JP3.4 19.65,37.17 20.02,36.52 19.34,36.21 JP3.4 | JP3.4 19.47,37.38 20.06,36.92 19.56,36.37 JP3.4 | JP3.4 19.56,37.29 20.06,36.73 19.46,36.28 JP3.4
P4_0
  Top 0.254: JP1.2 23,31.89 23.87,31.89 U$1.20
  Top 0.508: 23.87,31.89 23.25,32.31 JP1.2 23.39,31.31 23.87,31.89
P4_1
  Top 0.254: U$1.21 26.6,31.09 arc45 23.42,29.77 JP1.1
  Top 0.508: 23.58,29.92 22.83,29.89 JP1.1 23.55,29.18 23.58,29.92
P4_2
  Top 0.203: R1.2 22.86,26.67 23.6,27.41 arc-45 24.87,27.94 25.04,27.94 arc45 26.91,28.71 U$1.22
P4_3
  Top 0.203: R4.2 26.76,26.3 arc45 29.05,27.25 U$1.23
RST_3V  (via drill 0.3)
  Top 0.203: U$1.39 32.99,34.29 arc-90 v31.69,35.59 | v31.69,35.59 31.88,35.53 31.77,35.14 31.53,35.47 v31.69,35.59
  Bottom 0.203: v31.69,35.59 31.69,36.05 | 31.69,36.05 31.69,50.74 arc-90 WIFI-JP.5 | 31.69,36.05 31.51,35.68 v31.69,35.59 | 31.69,36.05 31.87,35.68 v31.69,35.59
  Bottom 0.406: 32.08,51.68 32.91,51.52 WIFI-JP.5 32.56,52.38 32.08,51.68
RX
  Top 0.203: WIFI-JP.8 29.76,48.81 29.75,48.8 arc45 28.49,45.76 U$1.12
  Top 0.406: 29.76,48.81 30.59,48.98 WIFI-JP.8 29.93,49.64 29.76,48.81
SWDIO
  Top 0.254: U$1.13 25.86,37.49 arc-20 24.05,37.81 21.46,38.73 | 21.46,38.73 20.05,39.19 19.23,39.45 | 19.94,39.5 19.81,38.99 21.46,38.73 | 21.46,38.73 20.06,39.44 19.94,39.5 | 19.94,39.5 19.23,39.45 | 19.23,39.45 18.97,38.89 JP3.5
  Top 0.508: JP3.5 19.6,39.78 20.05,39.19 19.41,38.79 JP3.5 | JP3.5 19.68,39.65 19.98,38.96 19.27,38.72 JP3.5 | JP3.5 19.48,39.9 20.06,39.44 19.54,38.89 JP3.5
TX
  Top 0.203: WIFI-JP.1 arc90 36.58,53.59 33.03,53.59 arc45 32.62,53.42 32.24,53.04 arc45 31.79,51.96 31.79,46.25 arc-45 30.75,43.75 30.7,43.7 arc45 30.29,42.7 U$1.11
VCC  (via drill 0.6)
  Top 0.203: 46.68,32.71 arc90 45.72,31.75 arc90 46.66,30.81 IC2.1 | 48.26,37.75 48.26,40.91 arc-90 IC1.5 | 48.26,37.75 48.26,33.83 arc-90 IC2.3 | L1.1-VDD 64.32,34.64 arc-45 63.47,34.29 C1.1 | C1.1 arc-82 56.89,29.32 arc-12 JP2.1 56.9,29.21 57.2,29.21 arc-90 C22.1 | C1.1 C2.1 | IC9.5 48.26,37.75 | 17.02,54.1 C10.1 arc90 11.07,49.6
  Top 0.254: IC2.3 46.68,32.71 | 49.53,29.21 54.86,29.21 JP2.1 | L13.1-VDD arc-90 8.14,26.88 C13.1 | L14.1-VDD 8.58,16.49 arc-90 C14.1 | L12.1-VDD arc-90 4.61,34.29 C12.1 | L10.1-VDD 11.07,49.6 | L11.1-VDD v3.48,41.7 C11.1 | C13.1 C12.1 | C13.1 C14.1 | C8.1 C9.1 arc90 14.27,56.97 L9.1-VDD | C8.1 C7.1 | C7.1 C6.1 | C6.1 C5.1 | C5.1 C4.1 | C4.1 C3.1 | C3.1 C2.1 60.44,41.7 arc90 L2.1-VDD | C21.1 C22.1 arc41 63.5,25.4 63.61,25.4 arc90 L22.1-VDD | C20.1 C19.1 | C19.1 C18.1 | C18.1 C17.1 | C17.1 C16.1 | C16.1 C15.1 | C15.1 C14.1 | C11.1 C10.1 | C12.1 C11.1 | L8.1-VDD 19.08,62.5 arc-90 C8.1 | L7.1-VDD arc-90 30.55,62.49 C7.1 | L6.1-VDD arc-90 38.03,64.85 C6.1 | L5.1-VDD arc-90 46.99,62.95 46.99,62.23 arc-48 C5.1 | L4.1-VDD 53.48,56.13 arc-90 C4.1 | L3.1-VDD 60,52.09 arc-90 C3.1 | L21.1-VDD 57.5,18.98 arc-90 C21.1 | L20.1-VDD 54.31,11.61 arc-90 C20.1 | C19.1 arc90 49.5,6.08 L19.1-VDD | C18.1 38.03,6.09 arc90 L18.1-VDD | C17.1 30.55,3.73 arc90 L17.1-VDD | C16.1 arc90 21.59,8.59 21.59,5.63 arc90 L16.1-VDD | C15.1 arc90 15.1,12.45 L15.1-VDD | C20.1 53.78,14.41 56.41,17.04 C21.1
  Top 0.305: IC2.1 47.93,30.81 arc-90 49.53,29.21 49.53,28.68 arc-45 49,27.41 46.99,25.4 D1.C
  Top 0.406: JP2.1 56.36,29.77 56.89,29.32 56.47,28.76 JP2.1 | JP2.1 56.41,29.72 56.9,29.21 56.41,28.7 JP2.1
  Top 0.508: 54.86,29.21 55.42,28.7 JP2.1 55.42,29.72 54.86,29.21
VCCD
  Top 0.254: U$1.33 38.29,26.49 C23.1

### Text on the board
tNames: supplyframe.com | supplyframe.com | LayerOne 2015 | Return of the | 1 | + | layerone.org | - | PROG | G | VCC | charliex | dout | 1 | - | + | Blinkenlights | 1 | DYNO I/O | www. | netdc | .com
bNames: www.netdc.com | supplyframe.com | + | + | hackaday.io/project/4207-layerone-2015-badge